# EAGLE design Itsy Bitsy 32u4 3V (EAGLE 9.6.2)
COMPANY: ADAFRUIT INDUSTRIES; DRAWN: KTOWN; REV: B
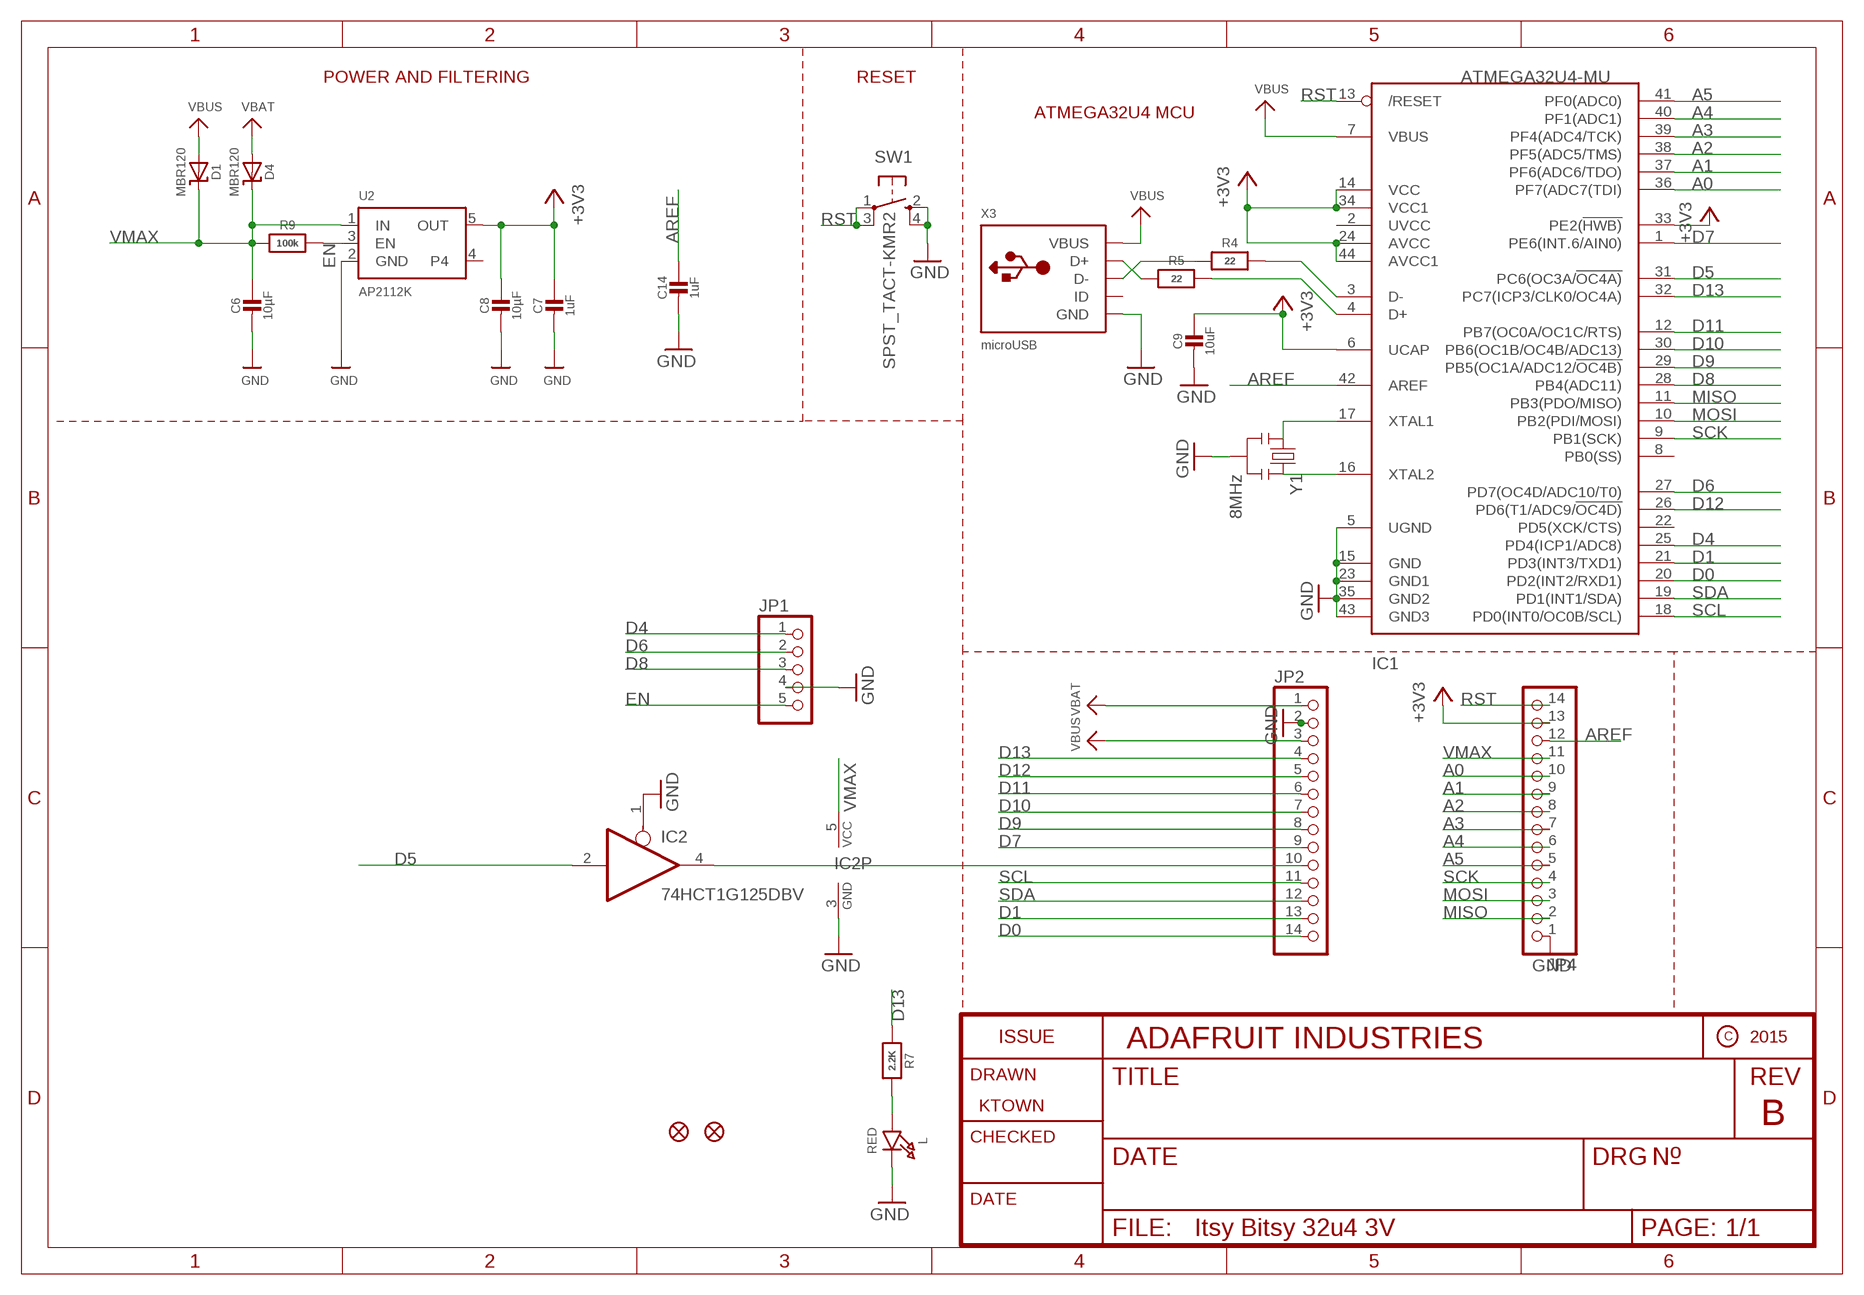
[diagram p0: schematic, sheet 1]

## Parts
C6  10µF  CAP_CERAMIC0805-NOOUTLINE  [0805-NO]
C7  1uF  CAP_CERAMIC0603_NO  [0603-NO]
C8  10µF  CAP_CERAMIC0805-NOOUTLINE  [0805-NO]
C9  10uF  CAP_CERAMIC0805-NOOUTLINE  [0805-NO]
C14  1uF  CAP_CERAMIC0603_NO  [0603-NO]
D1  MBR120  DIODE-SCHOTTKYSOD-123  [SOD-123]
D4  MBR120  DIODE-SCHOTTKYSOD-123  [SOD-123]
IC1  ATMEGA32U4-MU  [TQFN44_7MM]
IC2  74HCT1G125DBV  74AHC1G125DBV  [SOT23-5]
JP1  HEADER-1X5ROUND  [1X05_ROUND]
JP2  HEADER-1X14  [1X14_ROUND70]
JP4  HEADER-1X14  [1X14_ROUND70]
L  RED  LED0805_NOOUTLINE  [CHIPLED_0805_NOOUTLINE]
R4  22  RESISTOR_0603_NOOUT  [0603-NO]
R5  22  RESISTOR_0603_NOOUT  [0603-NO]
R7  2.2K  RESISTOR_0603_NOOUT  [0603-NO]
R9  100k  RESISTOR_0603_NOOUT  [0603-NO]
SW1  SPST_TACT-KMR2  [KMR2]
U2  AP2112K  VREG_SOT23-5  [SOT23-5]
U$34  FIDUCIAL""  [FIDUCIAL_1MM]
U$35  FIDUCIAL""  [FIDUCIAL_1MM]
X3  microUSB  USB_MICRO_20329_V2  [4UCONN_20329_V2]
Y1  8MHz  RESONATORSMD  [RESONATOR-SMD]

## Nets
+3V3: C7.1 C8.1 C9.1 IC1.6(UCAP) IC1.14(VCC) IC1.24(AVCC) IC1.33(PE2(!HWB)) IC1.34(VCC1) IC1.44(AVCC1) JP4.13 U2.5(OUT)
A0: IC1.36(PF7(ADC7(TDI)) JP4.10
A1: IC1.37(PF6(ADC6/TDO)) JP4.9
A2: IC1.38(PF5(ADC5/TMS)) JP4.8
A3: IC1.39(PF4(ADC4/TCK)) JP4.7
A4: IC1.40(PF1(ADC1)) JP4.6
A5: IC1.41(PF0(ADC0)) JP4.5
AREF: C14.1 IC1.42(AREF) JP4.12
D0: IC1.20(PD2(INT2/RXD1)) JP2.14
D1: IC1.21(PD3(INT3/TXD1)) JP2.13
D4: IC1.25(PD4(ICP1/ADC8)) JP1.1
D5: IC1.31(PC6(OC3A/!OC4A)) IC2.2(I)
D5_OUT: IC2.4(O) JP2.10
D6: IC1.27(PD7(OC4D/ADC10/T0)) JP1.2
D7: IC1.1(PE6(INT.6/AIN0)) JP2.9
D8: IC1.28(PB4(ADC11)) JP1.3
D9: IC1.29(PB5(OC1A/ADC12/!OC4B)) JP2.8
D10: IC1.30(PB6(OC1B/OC4B/ADC13)) JP2.7
D11: IC1.12(PB7(OC0A/OC1C/RTS)) JP2.6
D12: IC1.26(PD6(T1/ADC9/!OC4D)) JP2.5
D13: IC1.32(PC7(ICP3/CLK0/OC4A)) JP2.4 R7.1
D+: IC1.4(D+) R5.2
D-: IC1.3(D-) R4.2
EN: JP1.5 R9.2 U2.3(EN)
GND: C6.2 C7.2 C8.2 C9.2 C14.2 IC1.5(UGND) IC1.15(GND) IC1.23(GND1) IC1.35(GND2) IC1.43(GND3) IC2.1(OE) IC2.3(GND) JP1.4 JP2.2 JP4.1 L.C SW1.2(S) SW1.4(S1) U2.2(GND) X3.BASE@1(GND) X3.BASE@2(GND) X3.GND X3.SPRT@1(GND) X3.SPRT@2(GND) X3.SPRT@3(GND) X3.SPRT@4(GND) Y1.2
MISO: IC1.11(PB3(PDO/MISO)) JP4.2
MOSI: IC1.10(PB2(PDI/MOSI)) JP4.3
N$2: L.A R7.2
N$11: IC1.16(XTAL2) Y1.3
N$12: IC1.17(XTAL1) Y1.1
N$15: R5.1 X3.D+
N$16: R4.1 X3.D-
RST: IC1.13(/RESET) JP4.14 SW1.1(P) SW1.3(P1)
SCK: IC1.9(PB1(SCK)) JP4.4
SCL: IC1.18(PD0(INT0/OC0B/SCL)) JP2.11
SDA: IC1.19(PD1(INT1/SDA)) JP2.12
VBAT: D4.A JP2.1
VBUS: D1.A IC1.7(VBUS) JP2.3 X3.VBUS
VMAX: C6.1 D1.C D4.C IC2.5(VCC) JP4.11 R9.1 U2.1(IN)
Unconnected: IC1.2(UVCC) IC1.8(PB0(SS)) IC1.22(PD5(XCK/CTS)) U2.4 X3.ID

## Notes on the sheet
- POWER AND FILTERING | RESET
- ATMEGA32U4 MCU

## Library data of the parts
C6-C9 C14 = microbuilder:CAP_CERAMIC: Ceramic Capacitors For new designs, use the packages preceded by an '_' character since they are more reliable: The following footprints should be used on most boards: _0402 - Standard footprint for regular board layouts _0603 - Standard footprint for regular board layouts _0805 - Standard footprint for regular board layouts _1206 - Standard footprint for regular board layouts For extremely tight-pitch boards where space is at a premium, the following 'micro-pitch' footprints can be used (smaller pads, no silkscreen outline, etc.): _0402MP - Micro-pitch footprint for very dense/compact boards _0603MP - Micro-pitch footprint for very dense/compact boards _0805MP - Micro-pitch footprint for very dense/compact boards _1206MP - Micro-pitch footprint for very dense/compact boards
D1 D4 = microbuilder:DIODE-SCHOTTKY
IC1 = microbuilder:ATMEGA32U4: http://www.ladyada.net/library/eagle
IC2 = 74xx-little-us:74*1G125: Single Bus Buffer Gate with 3-State Output
JP1 = microbuilder:HEADER-1X5: PIN HEADER
JP2 JP4 = microbuilder:HEADER-1X14
L = microbuilder:LED: LED 0603 - 0603 Surface Mount Package 2mA: Green LED - Low Power (3.9mcd, 2ma, 1.7Vf) - Digikey: 475-2709-2-ND Orange LED - Low Power (9.8mcd, 2ma, 1.8Vf) - Digikey: 475-1194-2-ND Red LED - Low Power (5mcd, 2ma, 1.8Vf) - Digikey: 475-1195-2-ND Yellow LED - Low Power (7mcd, 2ma, 1.8Vf) - Digikey: 475-1196-2-ND 5mA: Blue LED - Low Power (17mcd, 5ma, 2.9Vf) - Digikey: LNJ937W8CRACT-ND 0805 - 0805 Surface Mount Package 2mA: Red LED (8.8mcd, 2mA, 1.8Vf, Clear) - Low Power [Digikey: 475-2510-1-ND] Green LED (5mcd, 2mA, 1.8Vf, Clear) - Low Power [Digikey: 475-2730-1-ND] Yellow LED (11.3mcd, 2mA, 1.8Vf, Clear) - Low Power [Digikey: 475-2555-1-ND] 20mA: Red LED (104mcd, 20mA, Diffused) - LS R976 [Digikey: 475-1278-6-ND] Red LED (12mcd, 20mA, 2.0Vf, Clear) - APT2012EC [Digikey: 754-1128-1-ND] Green LED (15mcd, 20mA, 2.2Vf, Clear) - APT2012GC [Digikey: 754-1131-1-ND] Orange LED (160mcd, 20mA, 2.1Vf, Clear) - APT2012SECK [Digikey: 754-1130-1-ND] 1206 - 1206 Surface Mount Package Green LED (26mcd, 20mA, Diffused) - LG N971 [Digikey: 475-1407-6-ND] Red LED (15mcd, 20mA, Diffused) - LH N974 [Digikey: 475-1416-6-ND] Cree - Cree High-Power Surface Mount LEDs XPEBWT-L1-0000-00D50 - White 111lm 350mA 2.9Vf 6200K 110° XTEAWT-00-0000-00000LEE3 - White 114lm 350mA 2.85Vf 5000K 115° Everlight - Everlight 45-21 Series Surface Mount LEDs 45-21/QK2C-B2832AC2CB2/2T - Warm White 2000mcd 20mA 3.25Vf 3050K 120° 45-21/LK2C-B38452C4CB2/2T - Nuetral White 2000mcd 20mA 3.25Vf 4150K 120° 45-21/LK2C-B50634C6CB2/2T - Cold White 2200mcd 20mA 3.25Vf 5650K 120° PLCC2 Reverse Mount LS T77K-J1L2-1-0-2-R18-Z - Red 11.25mcd 2mA 1.8Vf 630nm 120° LO T77K-L1M2-24-Z - Orange 19.6mcd 2mA 1.8Vf 606nm 120° LY T77K-K2M1-26-Z - Yellow 15.7mcd 2mA 1.8Vf 587nm 120°
R4 R5 R7 R9 = microbuilder:RESISTOR: Resistors For new designs, use the packages preceded by an '_' character since they are more reliable: The following footprints should be used on most boards: _0402 - Standard footprint for regular board layouts _0603 - Standard footprint for regular board layouts _0805 - Standard footprint for regular board layouts _1206 - Standard footprint for regular board layouts For extremely tight-pitch boards where space is at a premium, the following 'micro-pitch' footprints can be used (smaller pads, no silkscreen outline, etc.): _0402MP - Micro-pitch footprint for very dense/compact boards _0603MP - Micro-pitch footprint for very dense/compact boards _0805MP - Micro-pitch footprint for very dense/compact boards _1206MP - Micro-pitch footprint for very dense/compact boards
SW1 = adafruit:SPST_TACT: SMT 6mm switch, EVQQ2 series http://www.ladyada.net/library/eagle
U2 = microbuilder:VREG_SOT23-5: SOT23-5 Fixed Voltage Regulators Part Current Out V Out V In V Dropout θJA (°C/W) TJ (°C) Digikey Part No. ADP121 150mA 3.3V 3.4-5.5V 0.09V @ 150mA -- -- ADP121-AUJZ33R7CT-ND ADP121 150mA 3.0V 3.1-5.5V 0.09V @ 150mA -- -- ADP121-AUJZ30R7CT-ND ADP122 300mA 3.3V 3.4-5.5V 0.085V @ 300mA -- -- ADP122AUJZ-3.3-R7CT-ND ADP1712 300mA 3.3V 3.5-5.5V 0.17V @ 300mA -- -- ADP1712AUJZ-3.3-R7TR-ND AP7311 (Low Cost) 150mA 3.3V 3.5-6V 0.15V @ 150mA -- -- AP7311-33WG-7DICT-ND LD39015M18R 150mA 1.8V 1.9V-5.5V 0.08V @ 100mA -- -- 497-6977-1-ND LP2985A-33DBVR 150mA 3.3V 3.3-16V 0.28V @ 150mA 206 150 296-18479-1-ND MCP1824T-3302E/OT 300mA 3.3V 3.5V-6V 0.2V @ 300mA -- -- MCP1824T-3302E/OTCT-ND MIC5205-2.5YM5 TR 150mA 2.5V 2.7-16V 0.165V @ 150mA -- -- 576-1257-2-ND MIC5205-3.0YM5 TR 150mA 3.0V 3.2V-16V 0.165V @ 150mA -- -- 576-1258-2-ND MIC5205-3.3YM5 TR 150mA 3.3V 3.5V-16V 0.165V @ 150mA -- -- 576-1259-2-ND TPS780330220 150mA 3.3V+2.2V 3.6-5.5V 250mV Max -- -- 296-23332-1-ND TDA3663/N1,135 100mA 3.3V 3.5-45V 0.18V @ 50mA -- -- 568-5343-1-ND Max operating temp can be calculated using θJA, TJ (max junction temperature), and power in watts. Set the "Maximum Ambient Temperature" until it reaches TJ ("Max Junction Temperature"), which is the absolute limit for safe use of the regulator: Heat Sink Temperature Calculator <http://www.daycounter.com/Calculators/Heat-Sink-Temperature-Calculator.phtml> For example, With 12V source into a 3.3V LP2985 and a 30mA load, we are dissipating (12V-3.3V) * 0.03A = 0.261W. With a θJA of 206 °C/W, a TJ of 150°C, and 261mW we can safely use the chip without a heat sink up to 75°C (=147.1°C Junction Temperature).
U$34 U$35 = microbuilder:FIDUCIAL: Fiducial Alignment Points Various fiducial points for machine vision alignment.; BOM: EXCLUDE
X3 = microbuilder:USB: USB Connectors USBMINIB - Surface Mount Female Mini-B USB Connector 4UConnector: 06564
Y1 = SparkFun:RESONATOR: Resonator Small SMD resonator. This is the itty bitty 10/20MHz resonators with built in caps. CSTCE10M0G55 and CSTCE20M0V53. Footprint has been reviewed closely but hasn't been tested yet.

## Board
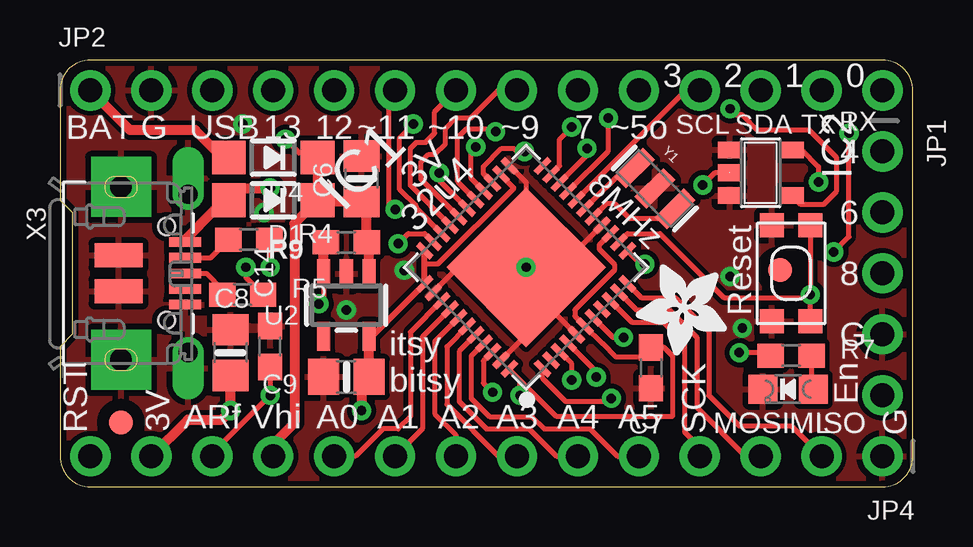
[diagram p1: board, top side]
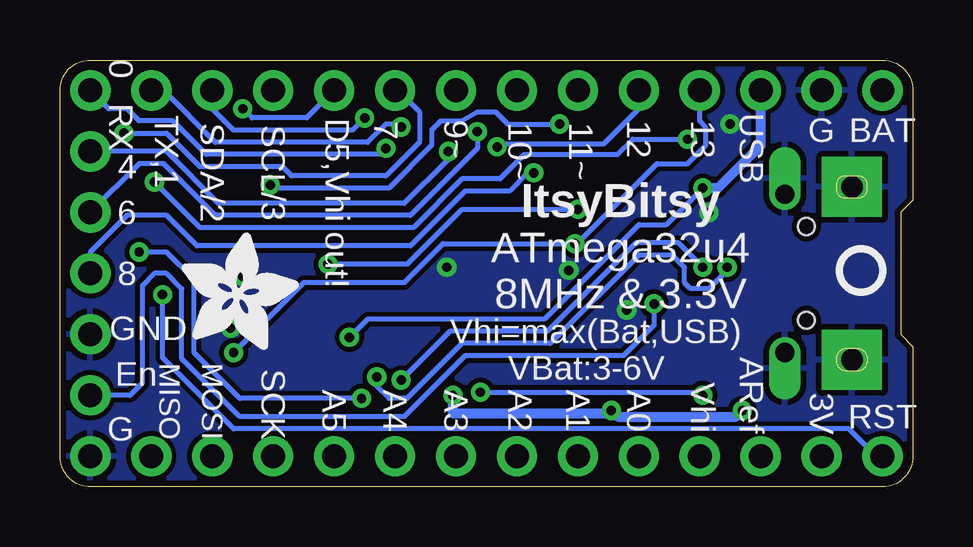
[diagram p2: board, bottom side, seen from below]

Size 35.56 x 17.78 mm. Coordinates in mm from the lower left corner, seen from the top.
Outline: 0,5.84 0,1.27 arc90 1.27,0 34.29,0 arc90 35.56,1.27 35.56,16.51 arc90 34.29,17.78 1.27,17.78 arc90 0,16.51 0,11.94 0.51,11.43 0.51,6.35 0,5.84
Copper layers (1*16): Top 0.035mm / dielectric 1.5mm / Bottom 0.035mm
Design rules "adafruit *": minimum track width 8mil, minimum drill 15.5mil, track to track 8mil, track to pad 8mil, pad to pad 8mil, via to via 8mil, smd to smd 8mil, copper to edge 10mil, drill to drill 8mil, minimum pad ring 10mil, minimum via ring 8mil, stop-mask expansion 2mil, vias tented up to drill 20mil, thermal gap 10mil

### Footprints (pad centres in the part's own frame; a part is rotated, then mirrored left to right if it is on the bottom)
0805-NO = smd 1.3 x 1.5: 1 -0.95,0; 2 0.95,0
0603-NO = smd 1.1 x 1: 1 -0.85,0; 2 0.85,0
SOD-123 = smd 1.4 x 1.4: A 1.85,0; C -1.85,0
TQFN44_7MM = smd 0.25 x 0.8: 1 -2.5,-3.475; 2 -2,-3.475; 3 -1.5,-3.475; 4 -1,-3.475; 5 -0.5,-3.475; 6 0,-3.475; 7 0.5,-3.475; 8 1,-3.475; 9 1.5,-3.475; 10 2,-3.475; 11 2.5,-3.475; 23 2.5,3.475; 24 2,3.475; 25 1.5,3.475; 26 1,3.475; 27 0.5,3.475; 28 0,3.475; 29 -0.5,3.475; 30 -1,3.475; 31 -1.5,3.475; 32 -2,3.475; 33 -2.5,3.475 | smd 0.8 x 0.25: 12 3.475,-2.5; 13 3.475,-2; 14 3.475,-1.5; 15 3.475,-1; 16 3.475,-0.5; 17 3.475,0; 18 3.475,0.5; 19 3.475,1; 20 3.475,1.5; 21 3.475,2; 22 3.475,2.5; 34 -3.475,2.5; 35 -3.475,2; 36 -3.475,1.5; 37 -3.475,1; 38 -3.475,0.5; 39 -3.475,0; 40 -3.475,-0.5; 41 -3.475,-1; 42 -3.475,-1.5; 43 -3.475,-2; 44 -3.475,-2.5 | smd 4.7 x 4.7: THERMAL 0,0
SOT23-5 = smd 0.69 x 0.99: 1 -0.95,-1.29; 2 0,-1.29; 3 0.95,-1.29; 4 0.95,1.3; 5 -0.95,1.3
1X05_ROUND = drill 1 pad 1.676: 1 -5.08,0; 2 -2.54,0; 3 0,0; 4 2.54,0; 5 5.08,0
1X14_ROUND70 = drill 1 pad 1.676: 1 -16.51,0; 2 -13.97,0; 3 -11.43,0; 4 -8.89,0; 5 -6.35,0; 6 -3.81,0; 7 -1.27,0; 8 1.27,0; 9 3.81,0; 10 6.35,0; 11 8.89,0; 12 11.43,0; 13 13.97,0; 14 16.51,0
CHIPLED_0805_NOOUTLINE = smd 1.2 x 1.2: A 0,-1.05; C 0,1.05
KMR2 = smd 1 x 1: 1 2,0.8; 2 2,-0.8; 3 -2,0.8; 4 -2,-0.8
SOT23-5' = smd 0.55 x 1.2: 1 -0.95,-1.3; 2 0,-1.3; 3 0.95,-1.3; 4 0.95,1.3; 5 -0.95,1.3
FIDUCIAL_1MM = smd 1 x 1: 1 0,0
4UCONN_20329_V2 = smd 1 x 2: BASE@1 -0.75,-2; BASE@2 0.75,-2 | smd 0.4 x 1.35: D+ 0,0.775; D- -0.65,0.775; GND 1.3,0.775; ID 0.65,0.775; VBUS -1.3,0.775 | drill 0.8 pad 1.2 offset: SPRT@1 -3.3,0.9; SPRT@2 3.3,0.9 | drill 0.9 pad 2.5 square: SPRT@3 -3.6,-1.9; SPRT@4 3.6,-1.9 | hole 0.7: -1.95,0; 1.95,0
RESONATOR-SMD = smd 0.7 x 1.7: 1 -1.2,0; 2 0,0; 3 1.2,0

### Placement (x,y rotation side)
C6  12.57,12.83 90 top
C7  24.64,4.95 270 top
C8  7.11,5.59 90 top
C9  11.94,4.57 180 top
C14  8.76,5.84 90 top
D1  8.89,11.94 180 top
D4  8.89,13.72 180 top
IC1  19.43,9.14 45 top
IC2  29.21,13.08 270 top
JP1  34.29,8.89 270 top
JP2  17.78,16.51 0 top
JP4  17.78,1.27 180 top
L  30.35,4.06 90 top
R4  7.87,10.29 0 top
R5  7.62,8 0 top
R7  30.48,5.46 0 top
R9  11.94,10.19 180 top
SW1  30.48,8.89 270 top
U2  AP2112K  [SOT23-5']  11.94,7.57 180 top
U$2  [PCBFEAT-REV-040]  2.16,9.02 0 bottom
U$4  [ADAFRUIT_5MM]  30.48,5.71 0 bottom
U$7  [ADAFRUIT_3.5MM]  27.81,9.27 180 top
U$34  2.54,2.67 270 top
U$35  30.02,9.02 270 top
X3  4.45,8.89 270 top
Y1  24.8,12.43 315 top

### Tracks (layer width: path | path; a pad name or v marks a point on that pad's centre or on a via)
+3V3  (via drill 0.39)
  Top 0.203: 22.61,5.97 IC1.6 21.46,7.11 21.46,7.37 23.11,9.02 23.11,9.27 22.48,9.91 22.48,10.07 IC1.14 | 22.61,5.97 | 22.61,5.97 23.15,5.42 24.34,5.42 24.64,5.71 C7.1 25.18,5.8 25.53,5.46 25.53,2.92 20.7,2.92 19.18,4.45 | IC1.24 18.39,12.98 18.92,12.45 15.75,9.27 15.21,9.27 | 19.18,4.45 18.74,4.88 IC1.44 | v19.18,3.81 19.18,4.45
  Top 0.254: U2.5 13.02,6.27 IC1.34 15.21,9.27 IC1.33
  Top 0.406: JP4.13 5.33,2.79 6.73,2.79 v7.11,3.17 C8.1 | U2.5 C9.1 12.57,4.26 v12.57,3.17
  Bottom 0.406: v12.57,3.17 12.45,3.05 | 12.45,3.05 12.32,2.92 7.37,2.92 v7.11,3.17 | 12.45,3.05 19.18,3.05 v19.18,3.81
A0
  Top 0.203: IC1.36 14.61,6.44 14.61,2.92 14.1,2.41 13.46,2.41 12.32,1.27 JP4.10
A1
  Top 0.203: IC1.37 15.11,6.24 15.11,2.41 JP4.9
A2
  Top 0.203: JP4.8 16.51,2.16 15.62,3.05 15.62,6.04 IC1.38
A3
  Top 0.203: JP4.7 18.29,1.27 16.13,3.43 16.13,5.84 IC1.39
A4
  Top 0.203: IC1.40 16.64,5.64 16.64,3.56 17.78,2.41 19.56,2.41 20.7,1.27 JP4.6
A5
  Top 0.203: IC1.41 17.14,5.44 17.14,3.68 17.91,2.92 19.68,2.92 20.19,2.41 22.1,2.41 23.24,1.27 JP4.5
AREF  (via drill 0.39)
  Top 0.203: C14.1 v8.76,3.81 6.35,1.4 JP4.12 | IC1.42 17.65,5.25 17.65,4.32 v18.03,3.94
  Bottom 0.203: v18.03,3.94 8.89,3.94 v8.76,3.81
D0  (via drill 0.39)
  Top 0.203: IC1.20 21.97,13.8 v21.97,14.1
  Bottom 0.203: JP2.14 33.53,15.75 32.77,15.75 32.26,15.24 30.86,15.24 29.46,13.84 22.1,13.84 21.97,13.97 v21.97,14.1
D1  (via drill 0.39)
  Top 0.203: IC1.21 20.83,13.37 20.83,14.48 v21.34,14.99
  Bottom 0.203: v21.34,14.99 21.34,15.11 | 21.21,15.11 21.34,15.11 | 21.34,15.11 21.97,15.11 22.73,14.35 29.08,14.35 31.24,16.51 JP2.13
D4  (via drill 0.39)
  Top 0.203: IC1.25 17.65,13.04 17.65,13.34 18.41,14.1 18.92,14.1 19.05,13.97 v19.37,13.97
  Bottom 0.203: JP1.1 31.11,13.97 28.96,11.81 21.21,11.81 19.37,13.65 v19.37,13.97
D5  (via drill 0.39)
  Top 0.203: IC1.31 14.86,11.6 14.86,11.68 14.16,12.38 14.16,14.54 v14.73,15.11 | IC2.2 27.3,13.08 v26.8,12.57
  Bottom 0.203: v14.73,15.11 16.89,15.11 17.4,15.62 18.16,15.62 18.8,15.24 19.68,15.24 20.07,14.86 20.07,14.22 21.84,12.45 26.67,12.45 v26.8,12.57
D5_OUT  (via drill 0.39)
  Top 0.203: v27.94,15.75 28.19,15.49 28.45,15.49 29.08,14.86 31.24,14.86 32.38,13.72 32.38,12.32 31.82,11.75 30.89,11.75 IC2.4
  Bottom 0.203: JP2.10 25.27,15.37 27.56,15.37 v27.94,15.75
D6  (via drill 0.39)
  Top 0.203: IC1.27 16.57,12.71 16.57,14.54 16.95,14.92 18.1,14.92 18.16,14.86 v18.16,14.8
  Bottom 0.203: v18.16,14.8 18.16,14.1 20.95,11.3 29.08,11.3 31.24,13.46 32.26,13.46 JP1.2
D7  (via drill 0.39)
  Top 0.203: v22.99,3.68 22.86,3.56 21.08,3.56 20.12,4.52 IC1.1 | v32.26,9.78 32.89,10.41 v32.89,14.73
  Bottom 0.203: v22.99,3.68 28.07,3.68 29.97,5.59 29.97,8.64 31.11,9.78 v32.26,9.78 | JP2.9 21.59,16.64 20.57,15.62 20.57,14.35 21.97,12.95 25.91,12.95 26.29,13.34 29.72,13.34 31.11,14.73 v32.89,14.73
D8  (via drill 0.39)
  Top 0.203: IC1.28 15.81,12.76 v15.81,13.08
  Bottom 0.203: v15.81,13.08 16.07,13.08 16.83,12.32 18.67,12.32 20.95,10.03 29.84,10.03 30.23,10.41 31.11,11.3 32.77,11.3 34.29,9.78 JP1.3
D9
  Top 0.203: JP2.8 18.29,16.51 17.14,15.37 16.51,15.37 16.07,14.92 16.07,14.29 15.62,13.84 15.37,13.84 15.05,13.53 15.05,12.82 IC1.29
D10
  Top 0.203: JP2.7 15.62,15.62 15.62,14.73 15.24,14.35 14.86,14.35 14.61,14.1 14.61,12.56 IC1.30
D11  (via drill 0.39)
  Top 0.203: IC1.12 24.22,9.27 v24.38,9.27 | v13.97,11.56 13.72,11.81 13.72,16.26 JP2.6
  Bottom 0.203: v24.38,9.27 21.08,9.27 18.8,11.56 v13.97,11.56
D12  (via drill 0.39)
  Top 0.203: IC1.26 17.14,12.84 17.14,13.97 v17.34,14.16
  Bottom 0.203: v17.34,14.16 17.21,14.29 12.89,14.29 11.43,15.75 JP2.5 11.43,16.38
D13  (via drill 0.39)
  Top 0.203: v14.1,10.13 14.51,10.54 15.21,10.54 IC1.32 | R7.1 29.5,5.59 v28.32,5.59
  Bottom 0.203: v28.32,5.59 25.4,8.51 21.21,8.51 19.59,10.13 v14.1,10.13 14,10.13 10.67,13.46 9.4,13.46 8.64,14.22 8.64,14.99 8.89,15.24 JP2.4
D+  (via drill 0.39)
  Top 0.203: IC1.4 22.35,4.81 v22.35,4.57 | v7.75,9.14 7.75,8.72 R5.2
  Bottom 0.203: v22.35,4.57 22.35,4.19 21.84,3.68 21.08,3.68 18.8,5.97 15.11,5.97 11.43,9.65 10.03,9.65 9.53,9.14 9.53,8.51 9.27,8.26 8.51,8.26 7.75,9.02 v7.75,9.14
D-  (via drill 0.39)
  Top 0.203: v21.34,4.45 21.34,5.12 IC1.3 | R4.2 8.72,9.18 v8.76,9.14
  Bottom 0.203: v8.76,9.14 9.78,10.16 11.56,10.16 15.24,6.48 19.3,6.48 v21.34,4.45
EN  (via drill 0.39)
  Top 0.203: U2.3 10.99,7.81 v10.79,7.62
  Top 0.406: U2.3 10.99,10.09 R9.2
  Bottom 0.203: v10.79,7.62 10.79,6.73 12.06,5.46 18.67,5.46 21.21,2.92 28.07,2.92 30.48,5.33 30.48,8.26 31.11,8.89 31.62,8.89 32.13,8.38 32.13,4.32 32.64,3.81 JP1.5
GND  (via drill 0.39)
  Top 0.203: IC1.43 19.43,6.32 19.43,8.44 | 19.43,8.44 v19.43,9.14 | IC1.35 16.6,9.14 v19.43,9.14 | IC1.23 19.43,12.68 v19.43,9.14 | IC1.15 20.84,9.14 v19.43,9.14 | IC1.5 19.43,8.44
  other vias: 14.35,9.02 7.62,15.11 27.94,8.76 28.45,6.6 8.51,11.43 11.94,7.37
  pour Top: 0,17.78 0,0 35.56,0 35.56,17.78
  pour Bottom: 0,0 35.56,0 35.56,17.78 0,17.78
MISO
  Top 0.203: IC1.11 24.24,7.87 25.65,7.87 27.05,6.48 27.05,3.81 28.32,2.54 30.48,2.54 JP4.2
MOSI
  Top 0.203: IC1.10 24.04,7.37 25.4,7.37 26.54,6.22 26.54,3.3 28.57,1.27 JP4.3
N$2
  Top 0.203: R7.2 31.33,4.14 L.A
N$11
  Top 0.203: IC1.16 22.8,11.81 23.11,11.81 23.75,11.18 25.15,11.18 25.55,11.58 Y1.3
N$12
  Top 0.203: IC1.17 23.57,13.28 Y1.1
N$15
  Top 0.203: X3.D+ 6.1,8.89 6.77,8.22 R5.1
N$16
  Top 0.203: X3.D- 6.28,9.54 R4.1
RST  (via drill 0.39)
  Top 0.203: SW1.3 v31.28,8 | IC1.13 23.66,10.54 25.02,10.54 27.69,7.87 31.24,7.87 31.28,7.91 v31.28,8 | 31.28,6.64 SW1.1 v31.28,8
  Bottom 0.203: JP4.14 1.52,1.27 2.67,2.41 28.32,2.41 31.28,5.37 v31.28,8
SCK
  Top 0.203: IC1.9 23.84,6.86 25.15,6.86 26.04,5.97 26.04,2.29 26.67,1.65 JP4.4
SCL
  Top 0.203: IC1.18 26.09,16.51 | 26.04,16.51 26.09,16.51 | 26.09,16.51 JP2.11
SDA  (via drill 0.39)
  Top 0.203: IC1.19 22.86,13.99 v22.86,15.37
  Bottom 0.203: JP2.12 29.21,15.75 28.32,14.86 23.37,14.86 v22.86,15.37
VBAT
  Top 0.406: JP2.1 2.92,14.86 5.64,14.86 6.79,13.72 D4.A
VBUS  (via drill 0.39)
  Top 0.203: IC1.7 23.06,6.22 v23.5,6.22
  Top 0.406: X3.VBUS 5.22,10.3 6.48,11.56 6.66,11.56 D1.A 7.55,12.45 v8.76,12.45
  Bottom 0.203: v8.76,12.45 10.29,10.92 11.43,10.92 15.37,6.99 22.73,6.99 v23.5,6.22
  Bottom 0.406: JP2.3 6.35,14.22 8.13,12.45 v8.76,12.45
VMAX  (via drill 0.39)
  Top 0.203: 10.74,13.91 9.96,13.91 v9.4,14.48 | v31.62,12.7 31.62,13.34 30.93,14.03 IC2.5
  Top 0.406: JP4.11 8.89,1.78 9.78,2.67 9.78,10.98 D1.C | D1.C D4.C 10.74,13.91 | D1.C 10.8,11.88 C6.1 12.79,11.66 R9.1 12.89,10.09 U2.1
  Bottom 0.203: v31.62,12.7 29.72,10.79 20.83,10.79 18.8,12.83 17.21,12.83 16.19,13.84 12.32,13.84 11.68,14.48 v9.4,14.48

### Text on the board
tPlace: 3 | 2 | 1 | 0 | BAT | G | USB | 13 | 12 | ~11 | ~ | 10 | ~9 | 7 | ~5o | SCL | SDA | TX | RX | 4 | 3V | 32u4 | 8MHz | 6 | Reset | 8 | G | RST | itsy / bitsy | SCK | 3V | ARf | Vhi | A0 | A1 | A2 | A3 | A4 | A5 | MOSI | MISO | En | G
bPlace: 0 | BAT | G | 7 | D5,Vhi out! | RX | USB | 13 | 12 | 11~ | 10~ | 9~ | TX,1 | SCL/3 | SDA/2 | 4 | ItsyBitsy | 6 | ATmega32u4 / 8MHz & 3.3V | 8 | GND | Vhi=max(Bat,USB) | En | ARef | VBat:3-6V | MOSI | MISO | RST | 3V | Vhi | A0 | A1 | A2 | A3 | A4 | A5 | SCK | G